# Altium schematic sheet 02 BLOCK DIAGRAM.SchDoc
size A3; SheetNumber: 2; SheetTotal: 3
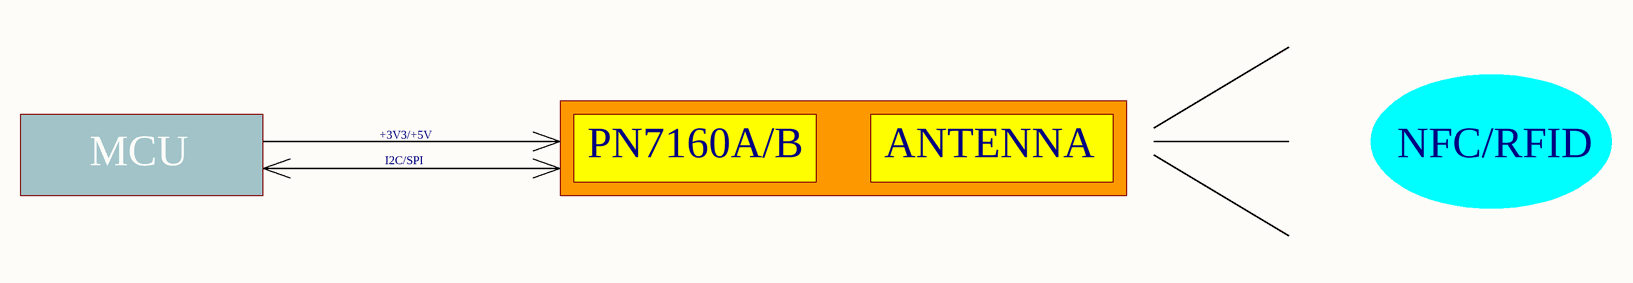
[diagram p0: 02 BLOCK DIAGRAM.SchDoc]

## Notes on the sheet
- +3V3/+5V
- I2C/SPI
- PN7160A/B
- ANTENNA
- NFC/RFID
- MCU
- Size
- Author
- Revision
- embedded-consultants.com <http://embedded-consultants.com>
- Sheet
- Date
- of